# EAGLE design wifi (EAGLE 9.5.2)
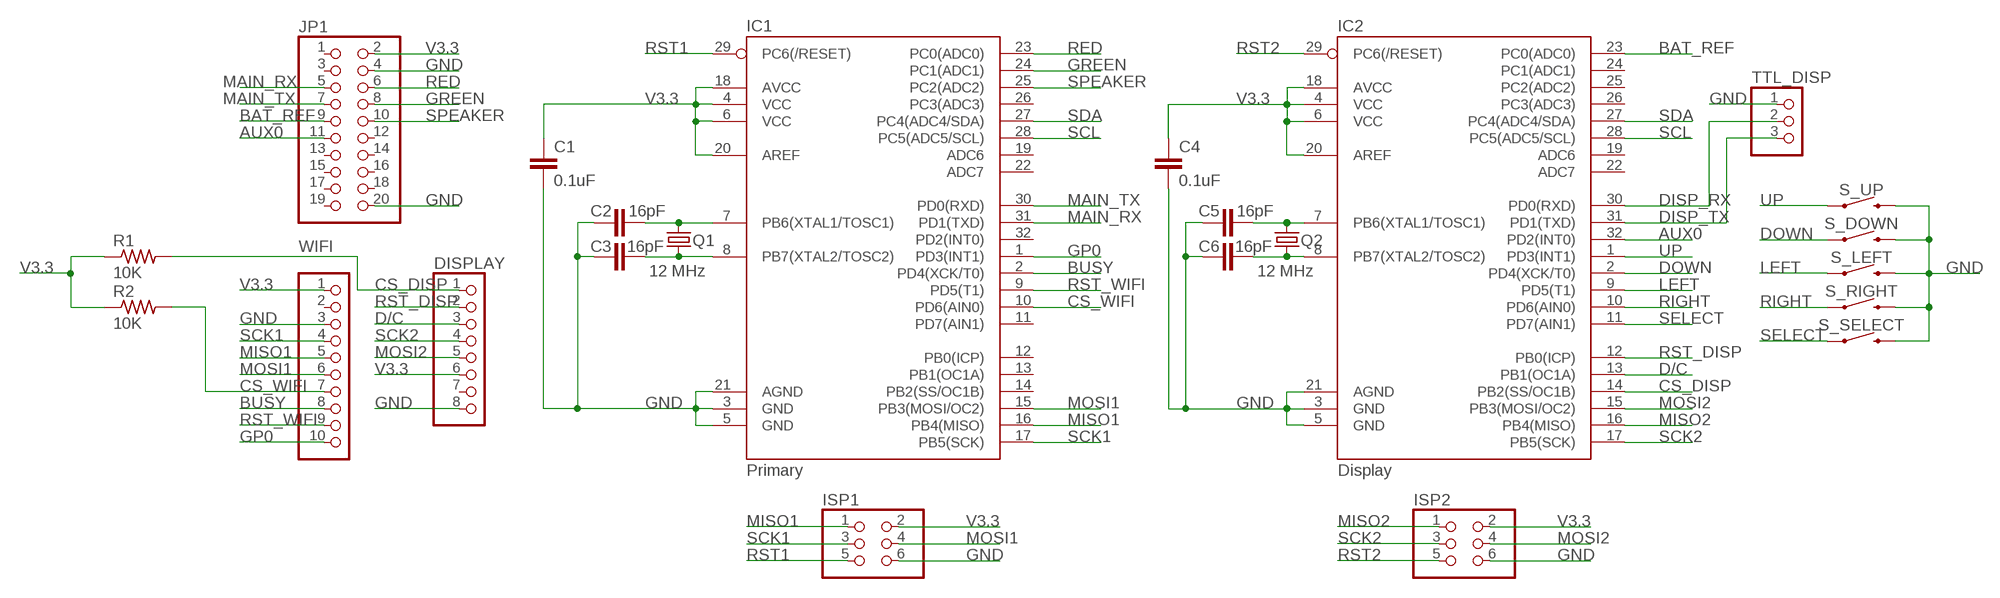
[diagram p0: schematic, sheet 1]

## Parts
C1  0.1uF  C-EUC1206  [C1206]
C2  16pF  C-EUC1206  [C1206]
C3  16pF  C-EUC1206  [C1206]
C4  0.1uF  C-EUC1206  [C1206]
C5  16pF  C-EUC1206  [C1206]
C6  16pF  C-EUC1206  [C1206]
DISPLAY  PINHD-1X8CLEANBIG  [1X08-CLEANBIG]
IC1  Primary  ATMEGA328P_TQFP  [TQFP32-08]
IC2  Display  ATMEGA328P_TQFP  [TQFP32-08]
ISP1  PINHD-2X3  [2X03]
ISP2  PINHD-2X3  [2X03]
JP1  PINHD-2X10  [2X10]
Q1  12 MHz  CRYSTALHC49S  [HC49/S]
Q2  12 MHz  CRYSTALHC49S  [HC49/S]
R1  10K  R-US_R1206  [R1206]
R2  10K  R-US_R1206  [R1206]
S_DOWN  MOMENTARY-SWITCH-SPST-PTH-6.0MM  [TACTILE_SWITCH_PTH_6.0MM]
S_LEFT  MOMENTARY-SWITCH-SPST-PTH-6.0MM  [TACTILE_SWITCH_PTH_6.0MM]
S_RIGHT  MOMENTARY-SWITCH-SPST-PTH-6.0MM  [TACTILE_SWITCH_PTH_6.0MM]
S_SELECT  MOMENTARY-SWITCH-SPST-PTH-6.0MM  [TACTILE_SWITCH_PTH_6.0MM]
S_UP  MOMENTARY-SWITCH-SPST-PTH-6.0MM  [TACTILE_SWITCH_PTH_6.0MM]
TTL_DISP  PINHD-1X3  [1X03]
WIFI  PINHD-1X10  [1X10-BIG]

## Nets
AUX0: IC2.32(PD2(INT0)) JP1.11
BAT_REF: IC2.23(PC0(ADC0)) JP1.9
BUSY: IC1.2(PD4(XCK/T0)) WIFI.8
CS_DISP: DISPLAY.1 IC2.14(PB2(SS/OC1B)) R1.2
CS_WIFI: IC1.10(PD6(AIN0)) R2.2 WIFI.7
D/C: DISPLAY.3 IC2.13(PB1(OC1A))
DISP_RX: IC2.30(PD0(RXD)) TTL_DISP.2
DISP_TX: IC2.31(PD1(TXD)) TTL_DISP.3
DOWN: IC2.2(PD4(XCK/T0)) S_DOWN.1
GND: C1.2 C2.1 C3.1 C4.2 C5.1 C6.1 DISPLAY.8 IC1.3(GND) IC1.5(GND) IC1.21(AGND) IC2.3(GND) IC2.5(GND) IC2.21(AGND) ISP1.6 ISP2.6 JP1.4 JP1.20 S_DOWN.3 S_LEFT.3 S_RIGHT.3 S_SELECT.3 S_UP.3 TTL_DISP.1 WIFI.3
GP0: IC1.1(PD3(INT1)) WIFI.10
GREEN: IC1.24(PC1(ADC1)) JP1.8
LEFT: IC2.9(PD5(T1)) S_LEFT.1
MAIN_RX: IC1.31(PD1(TXD)) JP1.5
MAIN_TX: IC1.30(PD0(RXD)) JP1.7
MISO1: IC1.16(PB4(MISO)) ISP1.1 WIFI.5
MISO2: IC2.16(PB4(MISO)) ISP2.1
MOSI1: IC1.15(PB3(MOSI/OC2)) ISP1.4 WIFI.6
MOSI2: DISPLAY.5 IC2.15(PB3(MOSI/OC2)) ISP2.4
N$2: C5.2 IC2.7(PB6(XTAL1/TOSC1)) Q2.2
N$3: C6.2 IC2.8(PB7(XTAL2/TOSC2)) Q2.1
N$13: C2.2 IC1.7(PB6(XTAL1/TOSC1)) Q1.2
N$14: C3.2 IC1.8(PB7(XTAL2/TOSC2)) Q1.1
RED: IC1.23(PC0(ADC0)) JP1.6
RIGHT: IC2.10(PD6(AIN0)) S_RIGHT.1
RST1: IC1.29(PC6(/RESET)) ISP1.5
RST2: IC2.29(PC6(/RESET)) ISP2.5
RST_DISP: DISPLAY.2 IC2.12(PB0(ICP))
RST_WIFI: IC1.9(PD5(T1)) WIFI.9
SCK1: IC1.17(PB5(SCK)) ISP1.3 WIFI.4
SCK2: DISPLAY.4 IC2.17(PB5(SCK)) ISP2.3
SCL: IC1.28(PC5(ADC5/SCL)) IC2.28(PC5(ADC5/SCL))
SDA: IC1.27(PC4(ADC4/SDA)) IC2.27(PC4(ADC4/SDA))
SELECT: IC2.11(PD7(AIN1)) S_SELECT.1
SPEAKER: IC1.25(PC2(ADC2)) JP1.10
UP: IC2.1(PD3(INT1)) S_UP.1
V3.3: C1.1 C4.1 DISPLAY.6 IC1.4(VCC) IC1.6(VCC) IC1.18(AVCC) IC1.20(AREF) IC2.4(VCC) IC2.6(VCC) IC2.18(AVCC) IC2.20(AREF) ISP1.2 ISP2.2 JP1.2 R1.1 R2.1 WIFI.1
Unconnected: DISPLAY.7 IC1.11(PD7(AIN1)) IC1.12(PB0(ICP)) IC1.13(PB1(OC1A)) IC1.14(PB2(SS/OC1B)) IC1.19(ADC6) IC1.22(ADC7) IC1.26(PC3(ADC3)) IC1.32(PD2(INT0)) IC2.19(ADC6) IC2.22(ADC7) IC2.24(PC1(ADC1)) IC2.25(PC2(ADC2)) IC2.26(PC3(ADC3)) JP1.1 JP1.3 JP1.12 JP1.13 JP1.14 JP1.15 JP1.16 JP1.17 JP1.18 JP1.19 WIFI.2

## Library data of the parts
C1-C6 = rcl:C-EU: CAPACITOR, European symbol; SPICEPREFIX: C
DISPLAY = adafruit:PINHD-1X8: PIN HEADER
IC1 IC2 = SparkFun-IC-Microcontroller:ATMEGA328P_TQFP: Popular 328P in QFP Storefront component: ATmega328 - TQFP <https://www.sparkfun.com/products/13448> (COM-13448) Datasheet <http://www.sparkfun.com/datasheets/Components/SMD/ATMega328.pdf> SparkFun Products SparkFun RedBoard - Programmed with Arduino <https://www.sparkfun.com/products/12757> (DEV-12757) Arduino Pro Mini 328 - 5V/16MHz <https://www.sparkfun.com/products/11113> (DEV-11113) Arduino Pro Mini 328 - 3.3V/8MHz <https://www.sparkfun.com/products/11114> (DEV-11114) SparkFun OpenLog <https://www.sparkfun.com/products/13712> (DEV-13712) SparkFun MicroView - OLED Arduino Module <https://www.sparkfun.com/products/12923> (DEV-12923) SparkFun Digital Sandbox <https://www.sparkfun.com/products/12651> (DEV-12651) SparkFun PicoBoard <https://www.sparkfun.com/products/11888> (WIG-11888) Arduino Fio <https://www.sparkfun.com/products/10116> (DEV-10116) LilyPad Arduino 328 Main Board <https://www.sparkfun.com/products/13342> (DEV-13342) SparkFun RedStick <https://www.sparkfun.com/products/13741> (DEV-13741) LilyPad MP3 <https://www.sparkfun.com/products/11013> (DEV-11013) LilyPad Arduino SimpleSnap <https://www.sparkfun.com/products/10941> (DEV-10941) SparkFun Stepoko <https://www.sparkfun.com/products/13899> (ROB-13899) SparkFun Geiger Counter <https://www.sparkfun.com/products/11345> (SEN-11345) SparkFun EL Sequencer <https://www.sparkfun.com/products/12781> (COM-12781) Arduino Pro 328 - 5V/16MHz <https://www.sparkfun.com/products/10915> (DEV-10915) CryptoCape <https://www.sparkfun.com/products/12773> (DEV-12773) SparkFun IR Thermometer Evaluation Board - MLX90614 <https://www.sparkfun.com/products/10740> (SEN-10740) SparkFun RedBot Mainboard <https://www.sparkfun.com/products/12097> (ROB-12097) Arduino Pro 328 - 3.3V/8MHz <https://www.sparkfun.com/products/10914> (DEV-10914) SparkFun Block for Intel® Edison - Arduino <https://www.sparkfun.com/products/13036> (DEV-13036) SparkFun Simon Says - Surface Mount Soldering Kit <https://www.sparkfun.com/products/10935> (KIT-10935) SparkFun 7-Segment Serial Display - Red <https://www.sparkfun.com/products/11441> (COM-11441) SparkFun 7-Segment Serial Display - White <https://www.sparkfun.com/products/11629> (COM-11629) SparkFun 7-Segment Serial Display - Yellow <https://www.sparkfun.com/products/11443> (COM-11443) SparkFun 7-Segment Serial Display - Kelly Green <https://www.sparkfun.com/products/11440> (COM-11440) SparkFun 7-Segment Serial Display - Blue <https://www.sparkfun.com/products/11442> (COM-11442) SparkFun OpenSegment Serial Display - 20mm (Blue) <https://www.sparkfun.com/products/11647> (COM-11647) SparkFun OpenSegment Serial Display - 20mm (Green) <https://www.sparkfun.com/products/11646> (COM-11646) SparkFun OpenSegment Serial Display - 20mm (White) <https://www.sparkfun.com/products/11648> (COM-11648) SparkFun OpenSegment Serial Display - 20mm (Red) <https://www.sparkfun.com/products/11644> (COM-11644) SparkFun OpenSegment Serial Display - 20mm (Yellow) <https://www.sparkfun.com/products/11645> (COM-11645) SparkFun OpenSegment Shield <https://www.sparkfun.com/products/13190> (DEV-13190); PROD_ID: IC-09069; VALUE: ATMEGA328P_TQFP
ISP1 ISP2 = pinhead:PINHD-2X3: PIN HEADER
JP1 = pinhead:PINHD-2X10: PIN HEADER
Q1 Q2 = adafruit:CRYSTAL: CRYSTAL; OC_FARNELL: 1667008; OC_NEWARK: unknown
R1 R2 = rcl:R-US_: RESISTOR, American symbol; SPICEPREFIX: R
S_DOWN S_LEFT S_RIGHT S_SELECT S_UP = SparkFun-Switches:MOMENTARY-SWITCH-SPST: Momentary Switch (Pushbutton) - SPST Normally-open (NO) SPST momentary switches (buttons, pushbuttons). Variants PTH-12MM - 12mm square, through-hole Momentary Pushbutton Switch - 12mm Square <https://www.sparkfun.com/products/9190> (COM-09190) PTH-6.0MM, PTH-6.0MM-KIT - 6.0mm square, through-hole Mini Pushbutton Switch <https://www.sparkfun.com/products/97> (COM-00097) KIT package intended for soldering kit's - only one side of pads' copper is exposed. PTH-RIGHT-ANGLE-KIT - Right-angle, through-hole Right Angle Tactile Button <https://www.sparkfun.com/products/10791> - Used on SparkFun BigTime Watch Kit <https://www.sparkfun.com/products/11734> SMD-12MM - 12mm square, surface-mount Tactile Button - SMD (12mm) <https://www.sparkfun.com/products/12993> (COM-12993) Used on SparkFun PicoBoard <https://www.sparkfun.com/products/11888> SMD-4.5MM - 4.5mm Square Trackball Switch Used on SparkFun Blackberry Trackballer Breakout <https://www.sparkfun.com/products/13169> SMD-4.6MMX2.8MM - 4.60mm x 2.80mm, surface mount Used on SparkFun SAMD21 Mini Breakout <https://www.sparkfun.com/products/13664> SMD-5.2MM, SMD-5.2-REDUNDANT - 5.2mm square, surface-mount Mini Pushbutton Switch - SMD <https://www.sparkfun.com/products/8720> (COM-08720) Used on Arduino Pro Mini <https://www.sparkfun.com/products/11114> REDUNDANT package connects both switch circuits together SMD-6.0X3.5MM - 6.0 x 3.5mm, surface mount Momentary Reset Switch SMD <https://www.sparkfun.com/products/8229> (COM-08229) SMD-6.2MM-TALL - 6.2mm square, surface mount Tactile Button - SMD (6mm) <https://www.sparkfun.com/products/12992> Used on SparkFun Digital Sandbox <https://www.sparkfun.com/products/12651> SMD-RIGHT-ANGLE - Right-angle, surface mount Used on SparkFun Block for Intel® Edison - Arduino <https://www.sparkfun.com/products/13036>; PROD_ID: SWCH-08441; SF_SKU: COM-00097
TTL_DISP = adafruit:PINHD-1X3: PIN HEADER
WIFI = adafruit:PINHD-1X10: Pin header 1x10 0.1" spacing With round pins

## Board
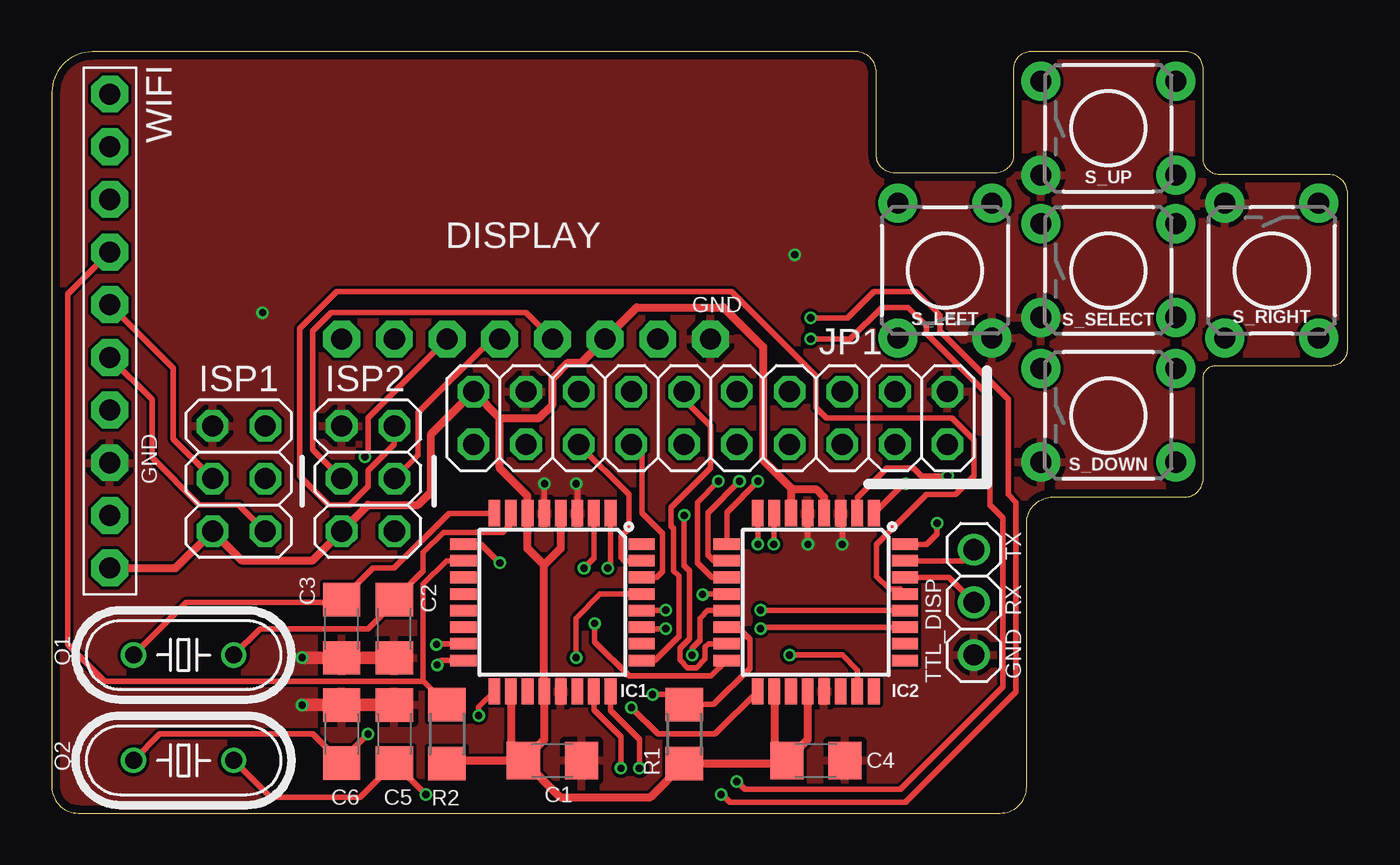
[diagram p1: board, top side]
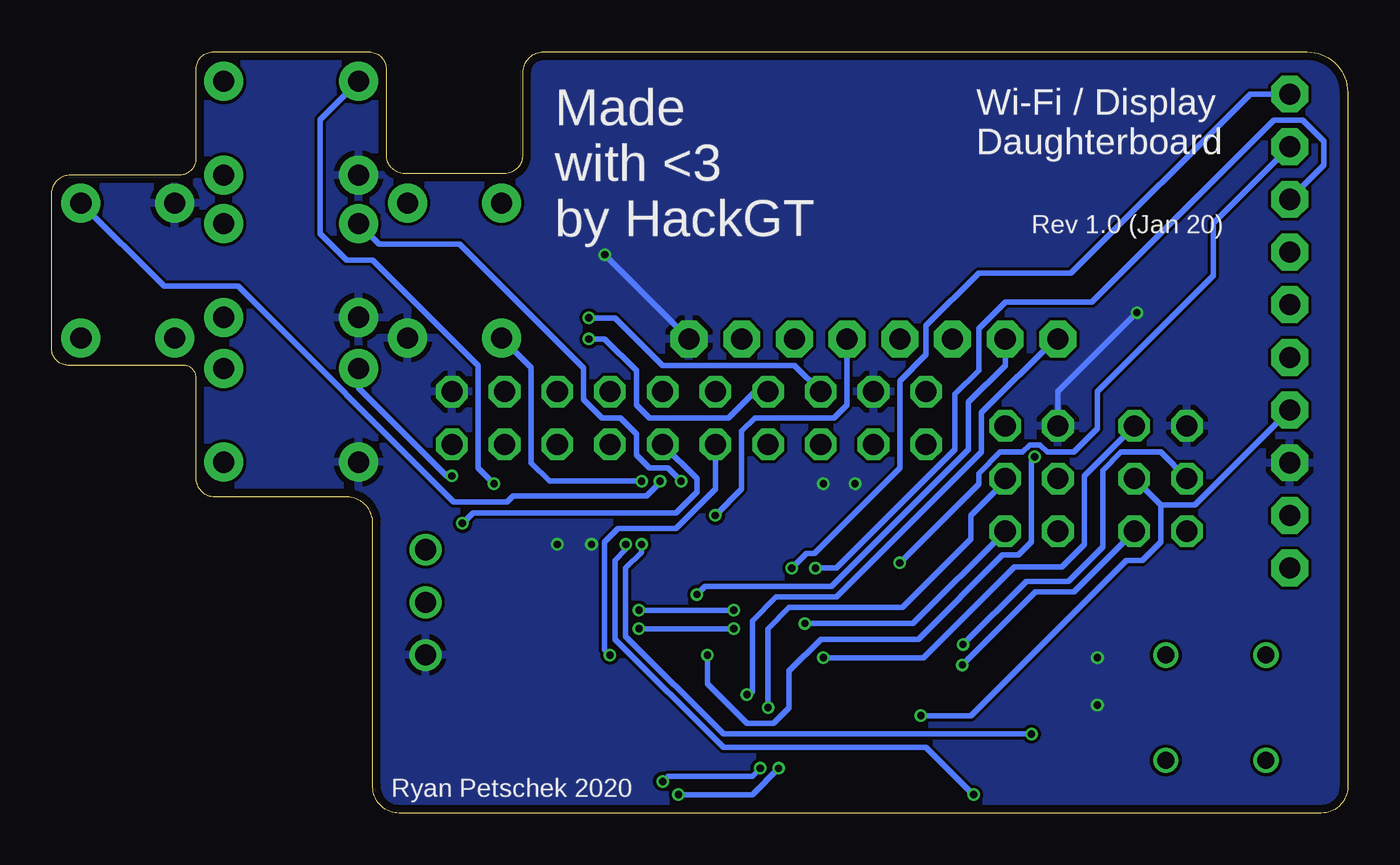
[diagram p2: board, bottom side, seen from below]

Size 62.46 x 36.7 mm. Coordinates in mm from the lower left corner, seen from the top.
Outline: 39.75,31.73 39.75,35.71 arc90 38.76,36.7 1.95,36.7 arc90 0,34.76 0,1.27 arc90 1.27,0 45.72,0 arc90 46.99,1.27 46.99,13.97 arc-90 48.26,15.24 54.61,15.24 arc90 55.5,16.13 55.5,20.95 arc-90 56.13,21.59 61.69,21.59 arc90 62.46,22.36 62.46,29.87 arc90 61.55,30.79 56.28,30.79 arc-90 55.5,31.56 55.5,35.88 arc90 54.68,36.7 47.17,36.7 arc90 46.35,35.88 46.35,31.73 arc-90 45.49,30.86 40.62,30.86 arc-90 39.75,31.73
Copper layers (1*16): Top 0.035559375mm / dielectric 1.6mm / Bottom 0.035559375mm
Design rules "oshpark-2layer *": minimum track width 10mil, minimum drill 10mil, track to track 6mil, track to pad 6mil, pad to pad 6mil, via to via 6mil, smd to smd 6mil, copper to edge 15mil, drill to drill 6mil, minimum pad ring 5mil, minimum via ring 5mil, stop-mask expansion 2.5mil, vias tented up to drill 0mil, thermal gap 10mil

### Footprints (pad centres in the part's own frame; a part is rotated, then mirrored left to right if it is on the bottom)
C1206 = smd 1.6 x 1.8: 1 -1.4,0; 2 1.4,0
1X08-CLEANBIG = drill 1.016 pad 1.778 octagon: 1 -8.89,0; 2 -6.35,0; 3 -3.81,0; 4 -1.27,0; 5 1.27,0; 6 3.81,0; 7 6.35,0; 8 8.89,0
TQFP32-08 = smd 1.27 x 0.559: 1 -4.293,2.8; 2 -4.293,2; 3 -4.293,1.2; 4 -4.293,0.4; 5 -4.293,-0.4; 6 -4.293,-1.2; 7 -4.293,-2; 8 -4.293,-2.8; 17 4.293,-2.8; 18 4.293,-2; 19 4.293,-1.2; 20 4.293,-0.4; 21 4.293,0.4; 22 4.293,1.2; 23 4.293,2; 24 4.293,2.8 | smd 0.559 x 1.27: 9 -2.8,-4.293; 10 -2,-4.293; 11 -1.2,-4.293; 12 -0.4,-4.293; 13 0.4,-4.293; 14 1.2,-4.293; 15 2,-4.293; 16 2.8,-4.293; 25 2.8,4.293; 26 2,4.293; 27 1.2,4.293; 28 0.4,4.293; 29 -0.4,4.293; 30 -1.2,4.293; 31 -2,4.293; 32 -2.8,4.293
2X03 = drill 1.016 octagon: 1 -2.54,-1.27; 2 -2.54,1.27; 3 0,-1.27; 4 0,1.27; 5 2.54,-1.27; 6 2.54,1.27
2X10 = drill 1.016 octagon: 1 -11.43,-1.27; 2 -11.43,1.27; 3 -8.89,-1.27; 4 -8.89,1.27; 5 -6.35,-1.27; 6 -6.35,1.27; 7 -3.81,-1.27; 8 -3.81,1.27; 9 -1.27,-1.27; 10 -1.27,1.27; 11 1.27,-1.27; 12 1.27,1.27; 13 3.81,-1.27; 14 3.81,1.27; 15 6.35,-1.27; 16 6.35,1.27; 17 8.89,-1.27; 18 8.89,1.27; 19 11.43,-1.27; 20 11.43,1.27
HC49/S = drill 0.813: 1 -2.413,0; 2 2.413,0
R1206 = smd 1.6 x 1.803: 1 -1.422,0; 2 1.422,0
TACTILE_SWITCH_PTH_6.0MM = drill 1.016 pad 1.88: 1 -3.251,2.261; 2 3.251,2.261; 3 -3.251,-2.261; 4 3.251,-2.261
1X03 = drill 1.016: 1 -2.54,0; 2 0,0; 3 2.54,0
1X10-BIG = drill 1.016 pad 1.778 octagon: 1 -11.43,0; 2 -8.89,0; 3 -6.35,0; 4 -3.81,0; 5 -1.27,0; 6 1.27,0; 7 3.81,0; 8 6.35,0; 9 8.89,0; 10 11.43,0

### Placement (x,y rotation side)
C1  24.13,2.54 0 top
C2  16.51,8.89 90 top
C3  13.97,8.89 90 top
C4  36.83,2.54 0 top
C5  16.51,3.81 270 top
C6  13.97,3.81 270 top
DISPLAY  22.86,22.86 0 top
IC1  24.13,10.16 270 top
IC2  36.83,10.16 270 top
ISP1  9.02,16.13 90 top
ISP2  15.24,16.13 90 top
JP1  31.75,19.05 0 top
Q1  6.35,7.62 0 top
Q2  6.35,2.54 0 top
R1  30.48,3.81 90 top
R2  19.05,3.81 90 top
S_DOWN  50.93,19.18 0 top
S_LEFT  43.05,26.16 90 top
S_RIGHT  58.8,26.16 270 top
S_SELECT  50.93,26.16 0 top
S_UP  50.93,33.02 0 top
TTL_DISP  44.45,10.16 90 top
WIFI  2.79,23.24 90 top

### Tracks (layer width: path | path; a pad name or v marks a point on that pad's centre or on a via)
AUX0  (via drill 0.35)
  Top 0.254: v42.67,13.97 42.67,13.46 42.16,12.95 IC2.32
  Bottom 0.254: JP1.11 31.37,16.13 31.37,15.49 32.38,14.48 42.16,14.48 v42.67,13.97
BAT_REF  (via drill 0.35)
  Top 0.254: v35.56,7.62 38.1,7.62 38.83,6.89 IC2.23
  Bottom 0.254: JP1.9 30.48,15.62 32.38,13.72 35.18,13.72 35.81,13.08 35.81,7.87 v35.56,7.62
BUSY  (via drill 0.35)
  Top 0.254: IC1.2 26.13,12.29 v25.65,11.82 v25.65,11.81
  Bottom 0.254: WIFI.8 1.14,31.24 1.14,32.39 2.16,33.4 3.56,33.4 12.32,24.64 16.51,24.64 17.78,23.37 17.78,21.34 18.92,20.19 18.92,17.53 24.64,11.81 v25.65,11.81
CS_DISP  (via drill 0.35)
  Top 0.254: IC2.14 33.08,8.96 33.66,8.38 33.66,6.99 31.9,5.23 R1.2 30,5.72 v28.96,5.72
  Bottom 0.254: DISPLAY.1 14.1,22.86 17.65,19.3 17.65,17.4 24.64,10.41 27.56,10.41 28.7,9.27 28.7,5.84 28.83,5.72 v28.96,5.72
CS_WIFI
  Top 0.254: R2.2 17.91,6.38 | IC1.10 19.02,12.16 17.91,11.05 17.91,6.38 | WIFI.7 0.76,25.02 0.76,8.13 2.54,6.35 17.88,6.35 17.91,6.38
D/C  (via drill 0.35)
  Top 0.254: DISPLAY.3 15.24,19.05 15.24,17.33 v15.08,17.18 | IC2.13 31.6,9.76 31.24,9.4 31.24,8.32 30.86,7.94 v30.86,7.62
  Bottom 0.254: v15.08,17.18 15.24,17.02 15.24,13.08 15.88,12.45 16.64,12.45 20.7,8.38 25.4,8.38 26.92,6.86 26.92,5.08 27.69,4.32 28.96,4.32 30.86,6.22 v30.86,7.62
DISP_RX
  Top 0.254: IC2.30 43.25,11.36 TTL_DISP.2
DISP_TX
  Top 0.254: IC2.31 43.91,12.16 TTL_DISP.3
DOWN  (via drill 0.35)
  Top 0.254: IC2.2 38.83,15.21 40.26,16.64 41.53,16.64 41.91,16.26 v43.18,16.26
  Bottom 0.254: v43.18,16.26 43.43,16.26 47.68,20.5 S_DOWN.1
GND  (via drill 0.35)
  Top 0.254: IC1.5 23.73,15.86 v23.75,15.88 | IC1.3 25.33,15.82 v25.27,15.88 | IC2.5 36.43,12.97 v36.45,12.95 | IC2.3 38.1,14.38 v38.1,12.95
  Top 0.61: C5.1 C6.1 v12.07,5.21 v12.06,5.21 | C2.1 C3.1 v12.07,7.49 v12.06,7.49
  Bottom 0.254: DISPLAY.8 v35.81,26.92 | ISP2.6 13.97,20.32 v10.16,24.13
  pour Top: -1.27,40.64 63.5,40.64 63.5,-1.27 -2.54,-1.27 -2.54,40.64
  pour Bottom: -1.27,40.64 63.5,40.64 63.5,-1.27 -2.54,-1.27 -2.54,40.64
GP0  (via drill 0.35)
  Top 0.254: v26.8,11.81 26.93,11.94 IC1.1
  Bottom 0.254: WIFI.10 4.7,34.67 13.34,26.04 17.78,26.04 20.32,23.5 20.32,22.1 21.59,20.83 21.59,16.64 25.71,12.52 26.09,12.52 v26.8,11.81
GREEN  (via drill 0.35)
  Top 0.254: IC1.24 26.93,4.95 28.32,3.56 v28.32,2.16 | v36.58,22.86 38.48,22.86 40.01,24.38 41.27,24.38 42.16,23.5 42.16,23.11 45.21,20.07 45.21,14.86 45.85,14.22 45.85,6.1 40.89,1.14 33.4,1.14 v33.02,1.52
  Bottom 0.254: JP1.8 28.57,20.32 29.84,19.05 33.66,19.05 34.29,19.69 34.29,21.34 35.81,22.86 v36.58,22.86 | v33.02,1.52 32.77,1.78 28.7,1.78 v28.32,2.16
LEFT  (via drill 0.35)
  Top 0.254: IC2.9 32.54,14.5 v34.04,16
  Bottom 0.254: v34.04,16 38.48,16 39.37,16.89 39.37,21.49 S_LEFT.1
MAIN_RX
  Top 0.254: IC1.31 27.59,12.16 27.43,12.32 27.43,13.34 27.81,13.72 27.81,15.37 JP1.5
MAIN_TX
  Top 0.254: JP1.7 28.45,17.27 28.45,14.48 29.44,13.49 29.44,11.66 29.14,11.36 IC1.30
MISO1  (via drill 0.35)
  Top 0.254: ISP1.1 9.02,14.86 7.11,14.86 4.83,17.15 4.83,19.94 WIFI.5 | IC1.16 18.79,7.36 v18.57,7.14
  Bottom 0.254: v18.57,7.14 15.05,10.67 13.21,10.67 ISP1.1
MISO2  (via drill 0.35)
  Top 0.254: v26.16,9.14 26.16,8.26 27.81,6.6 31.78,6.6 IC2.16
  Bottom 0.254: ISP2.1 20.95,9.14 v26.16,9.14
MOSI1  (via drill 0.35)
  Top 0.254: WIFI.6 5.84,21.46 5.84,18.03 ISP1.4 | IC1.15 18.57,8.16 v18.54,8.13
  Bottom 0.254: v18.54,8.13 15.49,11.18 13.46,11.18 11.81,12.83 11.81,16.51 10.92,17.4 9.02,17.4 ISP1.4
MOSI2  (via drill 0.35)
  Top 0.254: DISPLAY.5 22.86,24.13 13.46,24.13 12.57,23.24 12.57,17.53 ISP2.4 | v30.48,14.35 30.48,11.94 30.73,11.68 30.73,8.39 30.28,7.93 30.28,7.38 30.65,7.01 31.07,7.01 31.5,7.43 31.5,8 31.66,8.16 IC2.15
  Bottom 0.254: v30.48,14.35 29.21,15.62 29.21,18.41 28.57,19.05 24.77,19.05 24.13,19.69 DISPLAY.5
N$2  (via drill 0.35)
  Top 0.254: Q2.2 10.54,0.76 14.86,0.76 C5.2 v18.03,0.89 | v34.8,12.95 34.8,14.42 IC2.7
  Bottom 0.254: v34.8,12.95 34.8,12.7 35.31,12.19 35.31,8.38 30.1,3.18 20.32,3.18 v18.03,0.89
N$3  (via drill 0.35)
  Top 0.254: Q2.1 5.21,3.81 12.57,3.81 C6.2 13.97,2.54 v15.24,3.81 | IC2.8 v34.03,12.96 v34.04,12.95
  Bottom 0.254: v34.04,12.95 34.04,12.57 34.8,11.81 34.8,8.51 30.1,3.81 v15.24,3.81
N$13
  Top 0.254: Q1.2 10.03,8.89 15.24,8.89 16.51,10.16 C2.2 17.91,11.69 17.91,12.57 18.87,13.54 21.73,13.54 22.13,13.94 IC1.7
N$14
  Top 0.254: Q1.1 6.48,10.16 13.84,10.16 C3.2 15.49,11.81 16.51,11.81 19.15,14.45 IC1.8
RED  (via drill 0.35)
  Top 0.254: IC1.23 26.13,4.99 27.43,3.68 v27.43,2.16 | v36.58,23.88 38.35,23.88 39.62,25.15 41.66,25.15 42.8,24 42.8,23.24 46.1,19.94 46.1,15.37 46.48,14.99 46.48,5.84 41.15,0.51 32.7,0.51 32.32,0.89 v32.26,0.89
  Bottom 0.254: JP1.6 26.67,21.59 33.02,21.59 35.31,23.88 v36.58,23.88 | v27.43,2.16 28.7,0.89 v32.26,0.89
RIGHT  (via drill 0.35)
  Top 0.254: IC2.10 31.91,12.16 31.62,12.45 31.62,14.48 v33.15,16
  Bottom 0.254: v33.15,16 33.15,15.94 33.8,15.29 40.23,15.29 40.51,15.01 43.1,15.01 53.49,25.4 57.05,25.4 S_RIGHT.1
RST1  (via drill 0.35)
  Top 0.254: v25.27,7.49 25.27,9.4 26.43,10.56 IC1.29
  Bottom 0.254: ISP1.5 12.7,16.26 12.7,12.95 13.78,11.88 16.07,11.88 20.45,7.49 v25.27,7.49
RST2
  Top 0.254: ISP2.5 16.51,17.78 15.24,16.51 15.24,15.75 14.35,14.86 13.34,14.86 11.94,16.26 11.94,23.37 13.72,25.15 32.77,25.15 36.83,21.08 36.83,19.56 37.34,19.05 43.38,19.05 44.45,17.98 44.45,16.26 43.56,15.37 42.16,15.37 39.75,12.95 39.75,11.42 40.37,10.8 40.88,10.8 IC2.29
RST_DISP  (via drill 0.35)
  Top 0.254: v31.37,10.54 31.39,10.56 IC2.12
  Bottom 0.254: DISPLAY.2 16.51,21.59 18.29,19.81 18.29,17.53 24.89,10.92 30.99,10.92 v31.37,10.54
RST_WIFI  (via drill 0.35)
  Top 0.254: IC1.9 20.7,12.96 v21.59,12.07
  Bottom 0.254: v21.59,12.07 17.78,15.88 17.78,16.38 16.76,17.4 15.68,17.4 15.32,17.76 14.84,17.76 14.48,17.4 13.21,17.4 12.06,18.54 12.06,20.32 6.48,25.91 6.48,28.45 WIFI.9
SCK1  (via drill 0.35)
  Top 0.254: IC1.17 20.57,5.11 v20.57,4.7
  Bottom 0.254: WIFI.4 7.37,14.86 9.02,14.86 | 9.02,14.86 ISP1.3 | 9.02,14.86 9.02,13.08 9.91,12.19 10.67,12.19 18.16,4.7 v20.57,4.7
SCK2  (via drill 0.35)
  Top 0.254: IC2.17 31.97,3.81 29.21,3.81 v27.94,5.08 | ISP2.3 17.65,17.27 17.65,19.3 21.21,22.86 DISPLAY.4
  Bottom 0.254: v27.94,5.08 27.94,8.89 26.92,9.91 21.46,9.91 18.16,13.21 18.16,14.35 16.51,16 ISP2.3
SCL  (via drill 0.35)
  Top 0.254: IC2.28 34.18,9.76 v34.16,9.78 | v29.59,9.78 28.44,9.78 IC1.28
  Bottom 0.254: v34.16,9.78 v29.59,9.78
SDA  (via drill 0.35)
  Top 0.254: IC2.27 34.23,8.96 v34.16,8.89 | v29.59,8.89 28.49,8.89 IC1.27
  Bottom 0.254: v34.16,8.89 v29.59,8.89
SELECT  (via drill 0.35)
  Top 0.254: IC2.11 31.82,11.36 31.11,12.07 31.11,14.99 v32.13,16
  Bottom 0.254: v32.13,16 32.77,16.64 33.66,16.64 34.29,17.27 34.29,18.29 35.05,19.05 35.94,19.05 36.83,19.94 36.83,21.46 42.8,27.43 46.69,27.43 S_SELECT.1
SPEAKER
  Top 0.254: JP1.10 30.48,19.94 31.75,18.67 31.75,16.64 29.84,14.73 29.84,13.84 29.97,13.72 29.97,11.68 30.23,11.43 30.23,8.51 29.08,7.36 IC1.25
UP  (via drill 0.35)
  Top 0.254: IC2.1 41.05,15.88 v41.15,15.88
  Bottom 0.254: S_UP.1 49.53,33.43 49.53,27.94 48.26,26.67 46.99,26.67 41.91,21.59 41.91,16.64 v41.15,15.88
V3.3
  Top 0.381: WIFI.1 5.97,11.81 ISP1.2 9.14,12.19 12.57,12.19 ISP2.2 15.24,14.86 17.65,14.86 18.29,15.49 18.29,18.29 JP1.2 21.59,19.05 | 21.59,19.05 21.59,16.64 22.93,15.3 IC1.6 22.93,12.76 23.73,11.96 | 21.59,19.05 23.5,19.05 24.13,19.69 24.13,20.95 24.89,21.72 25.53,21.72 DISPLAY.6 28.19,24.38 32.38,24.38 34.29,22.48 34.29,17.02 35.63,15.68 | 35.63,15.68 IC2.6 | 35.63,15.68 35.69,15.62 36.83,15.62 37.23,15.22 IC2.4 | R2.1 19.2,2.54 C1.1 | IC1.18 22.13,3.14 C1.1 | C1.1 23.73,3.54 IC1.20 23.73,11.96 | C1.1 24.51,0.76 28.85,0.76 R1.1 35.28,2.39 C4.1 | IC2.18 34.83,3.14 C4.1 | IC2.20 36.43,3.54 C4.1 | IC1.4 24.53,12.76 23.73,11.96

### Text on the board
tPlace: GND | GND | TX | RX | GND
bNames: Wi-Fi / Display / Daughterboard | Rev 1.0 (Jan 20) | Made / with <3 / by HackGT | Ryan Petschek 2020